# EasyEDA schematic 0001.json
TITLE: Sheet_1; REV: 1.0; Date: 2020-10-04; Sheet: 1/1; Company: Your Company
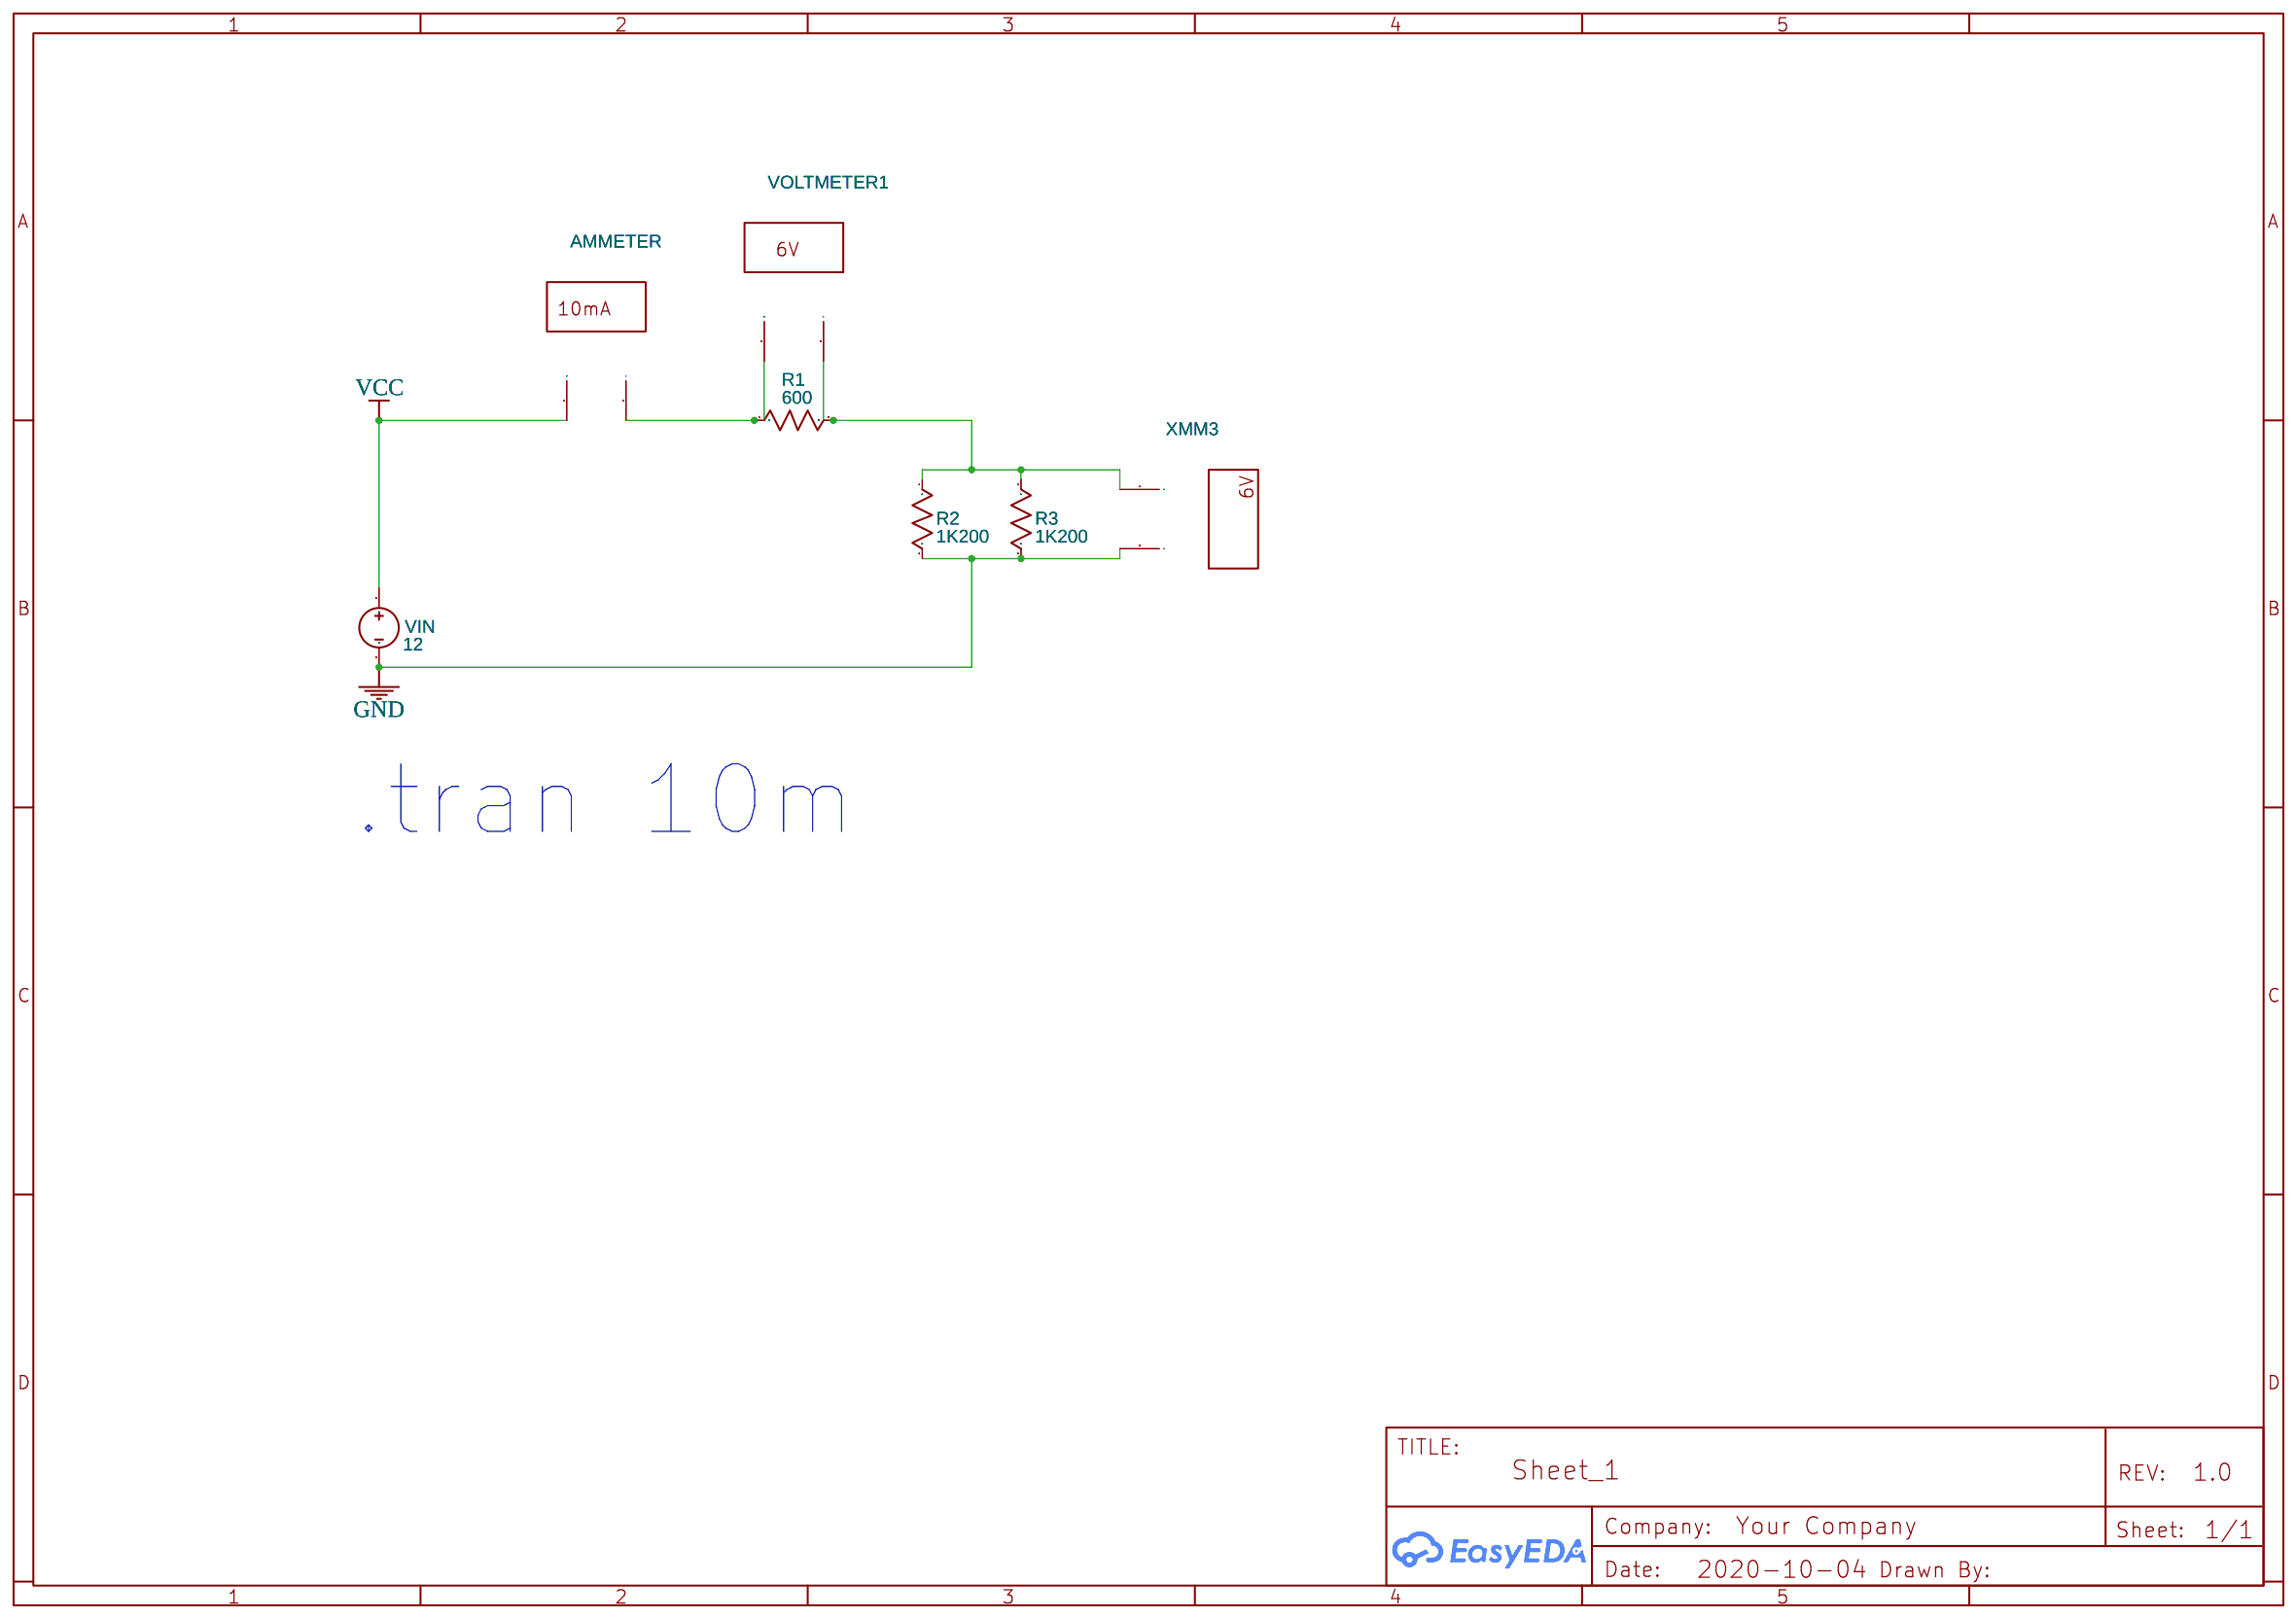
[diagram p0: schematic sheet]

## Parts
AMMETER  Multimeter
R1  600  [AXIAL-0.3]
R2  1K200  [AXIAL-0.3]
R3  1K200  [AXIAL-0.3]
VIN  12  [HDR1X2]
VOLTMETER1  Multimeter
XMM3  Multimeter

## Library data of the parts
AMMETER = MULTIMETER: Supplier: LCSC; Multimeter Type: Amper; Power Type: AC; Voltmeter resistance: 10μ; Ammeter resistance: 1G; NameDisplay: 0; Contributor: EasyEDA; sim: true
R1-R3 = Resistor_US: Resistance: 1k; Contributor: EasyEDA; Supplier: YUJING
VIN = VDC: Contributor: EasyEDA; sim: true
VOLTMETER1 XMM3 = MULTIMETER: Supplier: LCSC; Multimeter Type: Voltmeter; Power Type: AC; Voltmeter resistance: 10μ; Ammeter resistance: 1G; NameDisplay: 0; Contributor: EasyEDA; sim: true

## Nets
GND: R2.2 R3.2 VIN.2 XMM3.2(I)
VCC: AMMETER.1(+) VIN.1
Net-(AMMETER-2): AMMETER.2(I) R1.1 VOLTMETER1.1(+)
Net-(R1-2): R1.2 R2.1 R3.1 VOLTMETER1.2(I) XMM3.1(+)

## Notes on the sheet
- .tran 10m
